# EAGLE design multi (EAGLE 6.4)
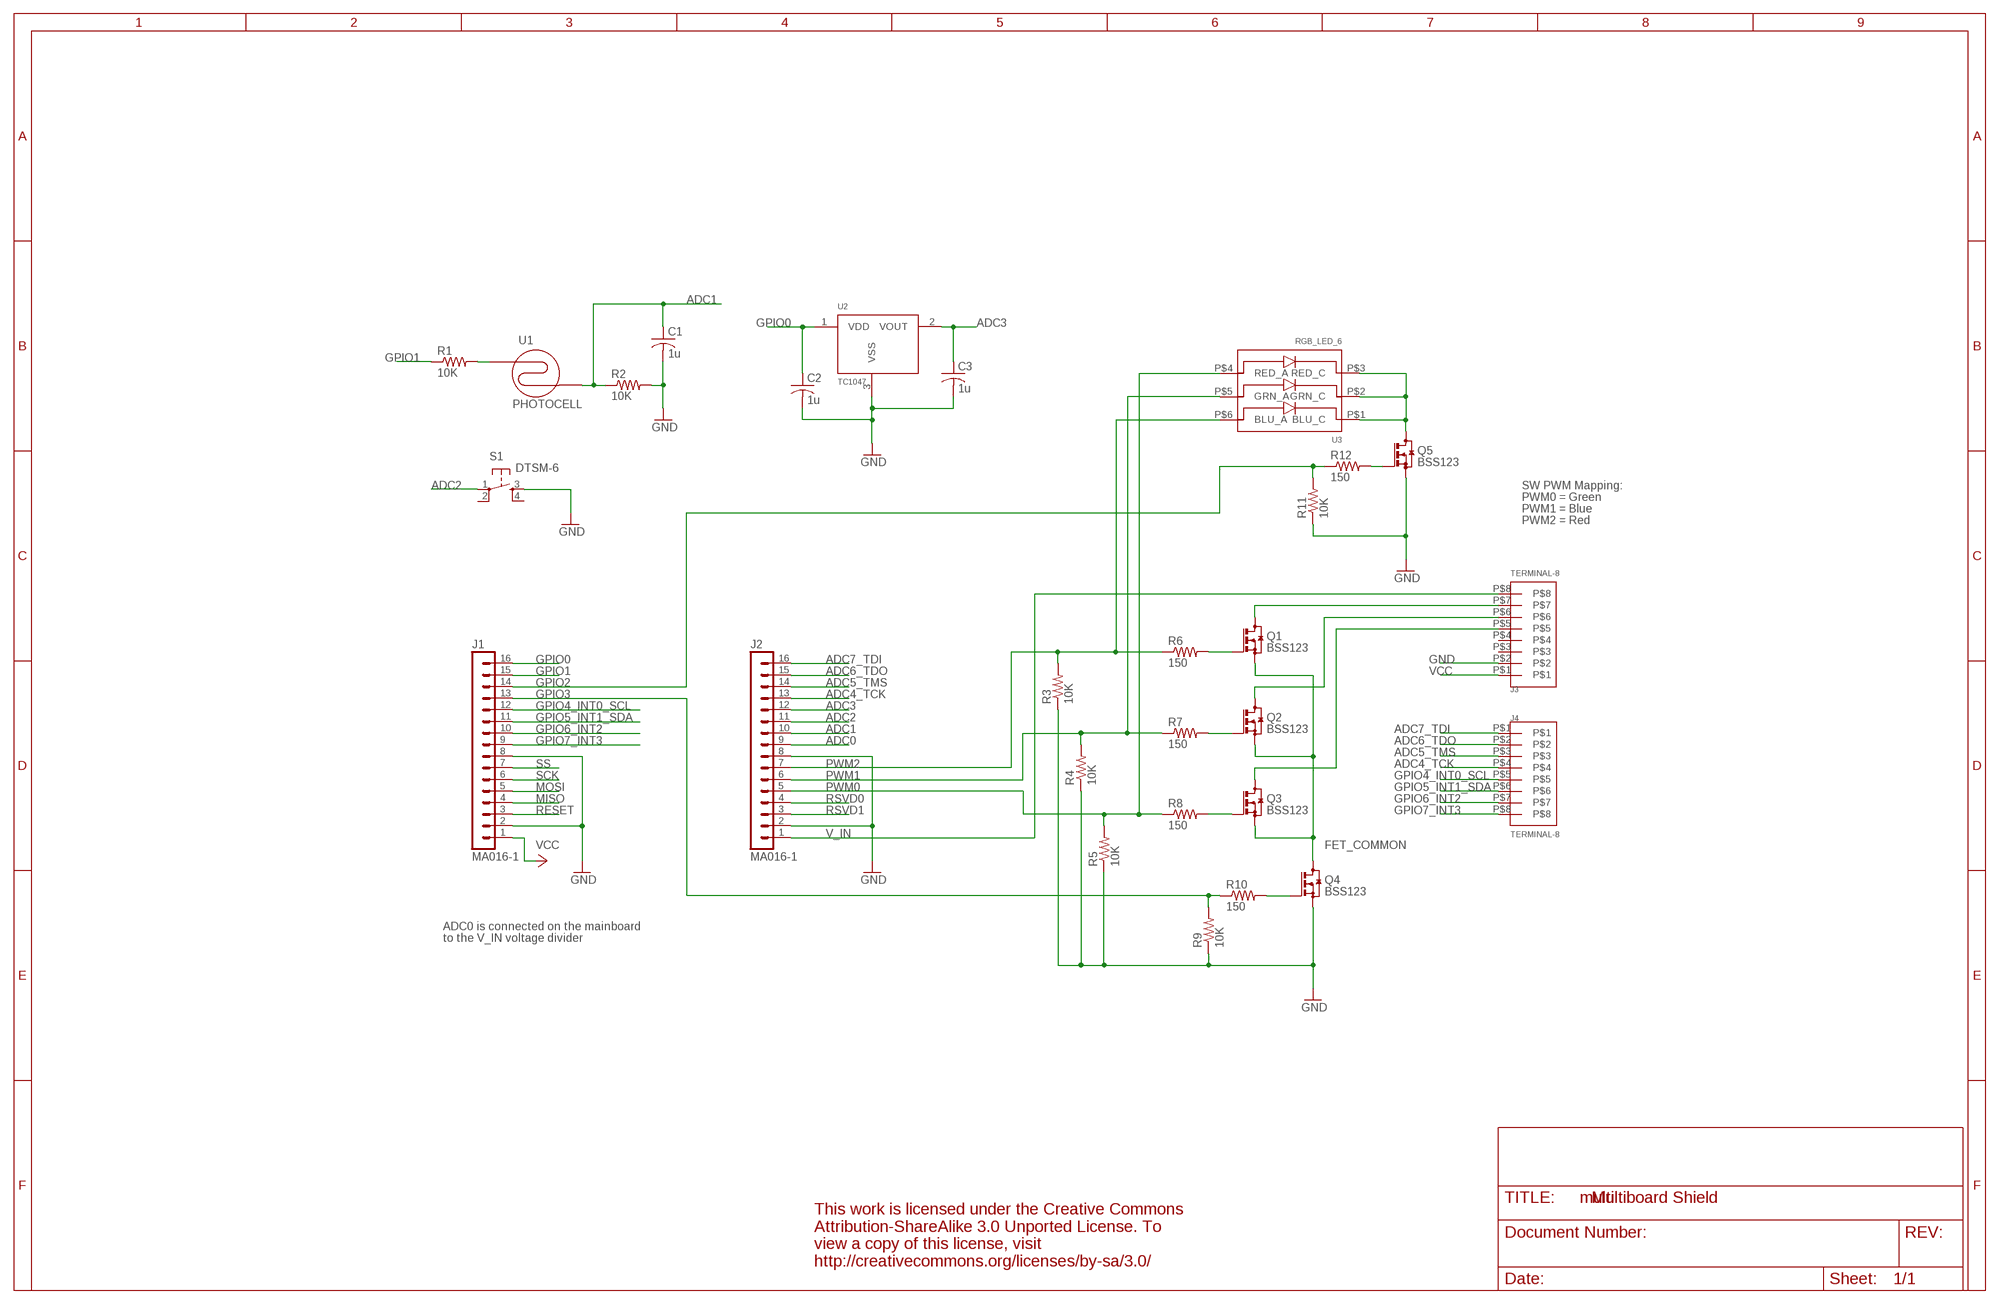
[diagram p0: schematic, sheet 1]

## Parts
C1  1u  C-USC0603K  [C0603K]
C2  1u  C-USC0603K  [C0603K]
C3  1u  C-USC0603K  [C0603K]
J1  MA016-1  [MA016-1]
J2  MA016-1  [MA016-1]
J3  TERMINAL-8  [TERMINAL-8]
J4  TERMINAL-8  [TERMINAL-8]
Q1  BSS123  [SOT23]
Q2  BSS123  [SOT23]
Q3  BSS123  [SOT23]
Q4  BSS123  [SOT23]
Q5  BSS123  [SOT23]
R1  10K  R-US_R0603  [R0603]
R2  10K  R-US_R0603  [R0603]
R3  10K  R-US_R0603  [R0603]
R4  10K  R-US_R0603  [R0603]
R5  10K  R-US_R0603  [R0603]
R6  150  R-US_R0603  [R0603]
R7  150  R-US_R0603  [R0603]
R8  150  R-US_R0603  [R0603]
R9  10K  R-US_R0603  [R0603]
R10  150  R-US_R0603  [R0603]
R11  10K  R-US_R0603  [R0603]
R12  150  R-US_R0603  [R0603]
S1  DTSM-6  [DTSM-6]
U1  PHOTOCELL  [PHOTOCELL]
U2  TC1047  [SOT23]
U3  RGB_LED_6  [PLCC6]

## Nets
ADC0: J2.9
ADC1: C1.1 J2.10 R2.1 U1.P$2
ADC2: J2.11 S1.1
ADC3: C3.1 J2.12 U2.2(VOUT)
ADC4_TCK: J2.13 J4.P$4
ADC5_TMS: J2.14 J4.P$3
ADC6_TDO: J2.15 J4.P$2
ADC7_TDI: J2.16 J4.P$1
FET_COMMON: Q1.2(S) Q2.2(S) Q3.2(S) Q4.3(D)
GND: C1.2 C2.2 C3.2 J1.2 J1.8 J2.2 J2.8 J3.P$2 Q4.2(S) Q5.2(S) R2.2 R3.1 R4.1 R5.1 R9.1 R11.1 S1.3 U2.3(VSS)
GPIO0: C2.1 J1.16 U2.1(VDD)
GPIO1: J1.15 R1.1
GPIO2: J1.14 R11.2 R12.1
GPIO3: J1.13 R9.2 R10.1
GPIO4_INT0_SCL: J1.12 J4.P$5
GPIO5_INT1_SDA: J1.11 J4.P$6
GPIO6_INT2: J1.10 J4.P$7
GPIO7_INT3: J1.9 J4.P$8
INA: Q2.1(G) R7.2
INB: Q1.1(G) R6.2
MISO: J1.4
MOSI: J1.5
N$1: R1.2 U1.P$1
N$2: Q5.3(D) U3.P$1(BLU_C) U3.P$2(GRN_C) U3.P$3(RED_C)
N$4: Q5.1(G) R12.2
N$5: Q3.1(G) R8.2
N$6: Q4.1(G) R10.2
OUT0: J3.P$5 Q3.3(D)
OUT1: J3.P$6 Q2.3(D)
OUT2: J3.P$7 Q1.3(D)
PWM0: J2.5 R5.2 R8.1 U3.P$4(RED_A)
PWM1: J2.6 R4.2 R7.1 U3.P$5(GRN_A)
PWM2: J2.7 R3.2 R6.1 U3.P$6(BLU_A)
RESET: J1.3
RSVD0: J2.4
RSVD1: J2.3
SCK: J1.6
SS: J1.7
V_IN: J2.1 J3.P$8
VCC: J1.1 J3.P$1
Unconnected: J3.P$3 J3.P$4 S1.2 S1.4

## Notes on the sheet
- SW PWM Mapping:
- PWM0 = Green
- PWM1 = Blue
- PWM2 = Red
- ADC0 is connected on the mainboard
- to the V_IN voltage divider
- Multiboard Shield

## Library data of the parts
C1-C3 = rcl:C-US: CAPACITOR, American symbol
J1 J2 = sapphire:MA016-1
J3 J4 = sapphire:TERMINAL-8
Q1-Q5 = transistor-small-signal:BSS123: N-CHANNEL MOS FET
R1-R12 = rcl:R-US_: RESISTOR, American symbol
S1 = sapphire:DTSM-6
U1 = sapphire:PHOTOCELL
U2 = sapphire:TC1047
U3 = sapphire:RGB_LED_6

## Board
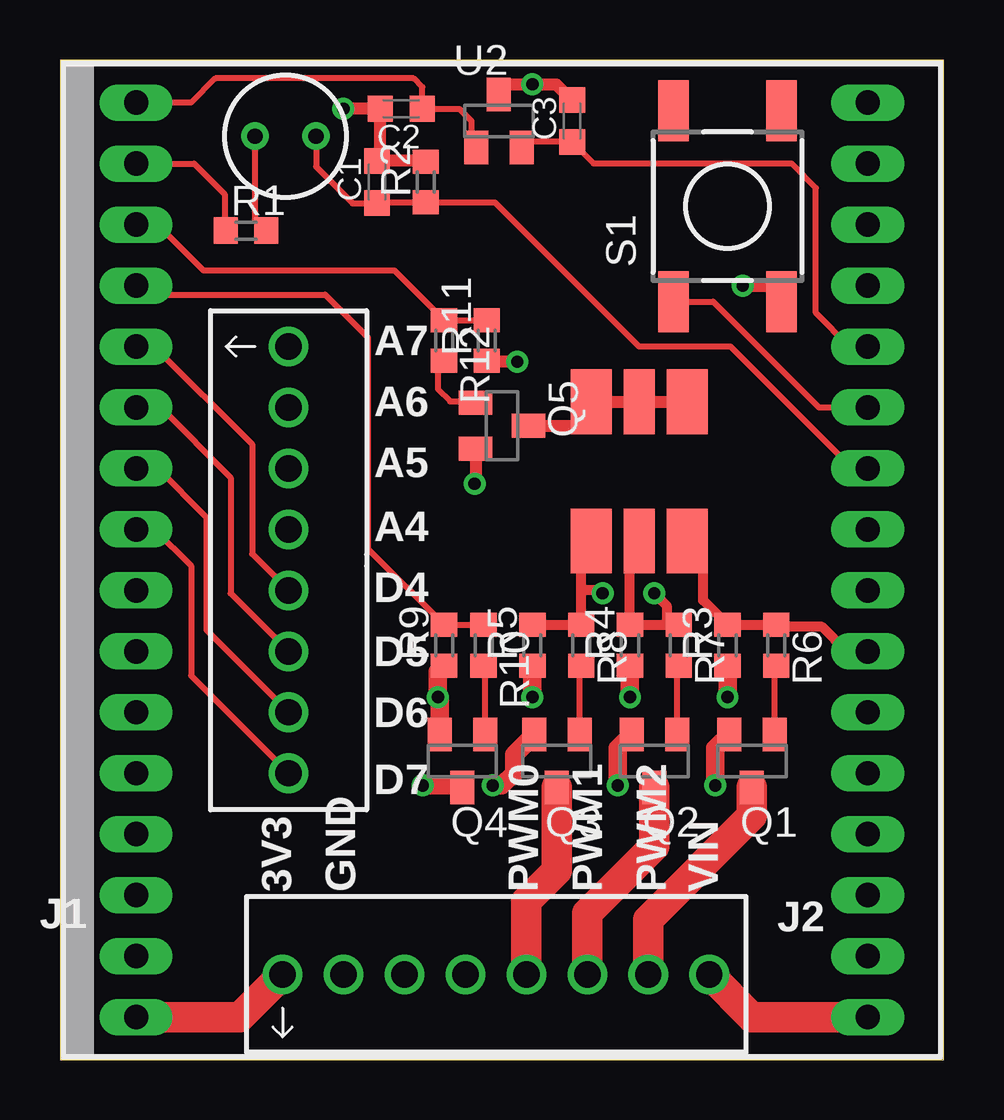
[diagram p1: board, top side]
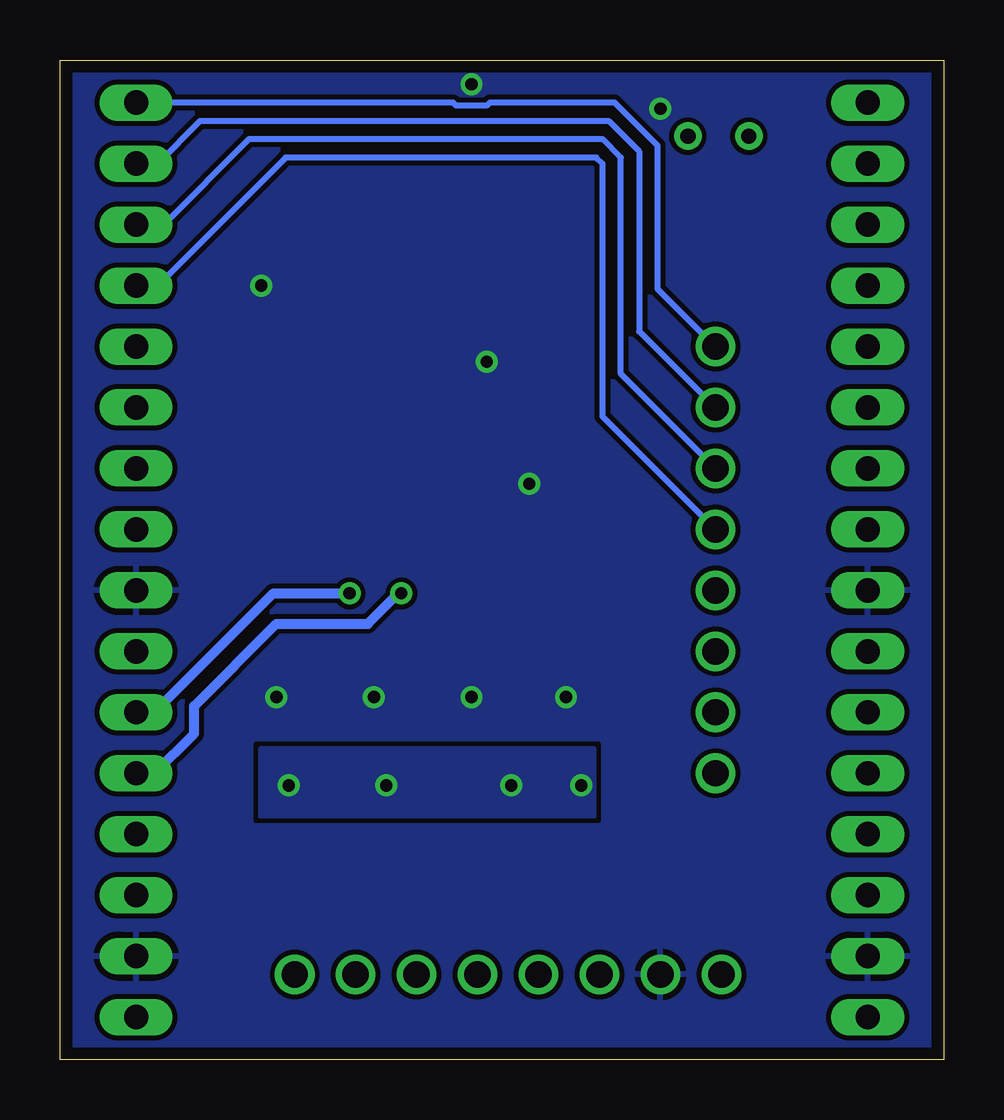
[diagram p2: board, bottom side, seen from below]

Size 36.83 x 41.66 mm. Coordinates in mm from the lower left corner, seen from the top.
Outline: 0,0 36.83,0 36.83,41.66 0,41.66 0,0
Copper layers (1*16): Top 0.035mm / dielectric 1.5mm / Bottom 0.035mm
Design rules "default": minimum track width 10mil, minimum drill 20mil, track to track 8mil, track to pad 8mil, pad to pad 6mil, via to via 8mil, smd to smd 8mil, copper to edge 20mil, drill to drill 8mil, minimum pad ring 10mil, minimum via ring 8mil, stop-mask expansion 4mil, vias tented up to drill 0mil, thermal gap 10mil

### Footprints (pad centres in the part's own frame; a part is rotated, then mirrored left to right if it is on the bottom)
C0603K = smd 1.05 x 1.08: 1 -0.875,0; 2 0.875,0
MA016-1 = drill 1.016 long: 1 -19.05,0; 2 -16.51,0; 3 -13.97,0; 4 -11.43,0; 5 -8.89,0; 6 -6.35,0; 7 -3.81,0; 8 -1.27,0; 9 1.27,0; 10 3.81,0; 11 6.35,0; 12 8.89,0; 13 11.43,0; 14 13.97,0; 15 16.51,0; 16 19.05,0
TERMINAL-8 = drill 1.1: P$1 -8.89,0; P$2 -6.35,0; P$3 -3.81,0; P$4 -1.27,0; P$5 1.27,0; P$6 3.81,0; P$7 6.35,0; P$8 8.89,0
SOT23 = smd 1 x 1.4: 1 -0.95,-1.1; 2 0.95,-1.1; 3 0,1.1
R0603 = smd 1 x 1.1: 1 -0.85,0; 2 0.85,0
DTSM-6 = smd 2.54 x 1.27: 1 -3.975,2.25; 2 3.975,2.25; 3 -3.975,-2.25; 4 3.975,-2.25
PHOTOCELL = drill 0.635: P$1 -1.27,0; P$2 1.27,0
PLCC6 = smd 2.7 x 1.7: P$1 -2.9,2; P$3 -2.9,-2; P$4 2.9,-2; P$6 2.9,2 | smd 2.7 x 1.3: P$2 -2.9,0; P$5 2.9,0

### Placement (x,y rotation side)
C1  13.21,36.58 90 top
C2  14.22,39.62 180 top
C3  21.34,39.12 90 top
J1  3.17,20.83 90 top
J2  33.66,20.83 90 top
J3  18.16,3.56 0 top
J4  9.53,20.83 270 top
Q1  28.83,12.45 180 top
Q2  24.77,12.45 180 top
Q3  20.7,12.45 180 top
Q4  16.76,12.45 180 top
Q5  18.41,26.42 270 top
R1  7.75,34.54 0 top
R2  15.24,36.58 90 top
R3  27.81,17.27 90 top
R4  23.75,17.27 90 top
R5  19.68,17.27 90 top
R6  29.84,17.27 270 top
R7  25.78,17.27 270 top
R8  21.72,17.27 270 top
R9  16,17.27 90 top
R10  17.65,17.27 270 top
R11  17.78,29.97 90 top
R12  16,29.97 270 top
S1  27.81,35.56 90 top
U1  9.4,38.48 0 top
U2  18.29,39.12 0 top
U3  24.13,24.51 270 top

### Tracks (layer width: path | path; a pad name or v marks a point on that pad's centre or on a via)
ADC1
  Top 0.254: U1.P$2 10.67,37.21 12.19,35.69 13.19,35.69 C1.1 13.23,35.73 R2.1 18.12,35.73 24.13,29.72 27.94,29.72 33.02,24.64 J2.10
ADC2
  Top 0.254: S1.1 27.22,31.59 31.62,27.18 J2.11
ADC3
  Top 0.254: J2.12 32.89,29.72 31.5,31.11 31.5,36.32 30.48,37.34 22.24,37.34 C3.1 19.46,38.24 U2.2
ADC4_TCK
  Bottom 0.254: J4.P$4 14.22,26.8 14.22,37.34 14.48,37.59 27.43,37.59 32.77,32.26 J2.13
ADC5_TMS
  Bottom 0.254: J4.P$3 13.46,28.57 13.46,37.59 14.22,38.35 28.96,38.35 32.51,34.8 J2.14
ADC6_TDO
  Bottom 0.254: J2.15 32.77,37.34 30.99,39.12 13.97,39.12 12.7,37.85 12.7,30.35 J4.P$2
ADC7_TDI
  Bottom 0.254: J4.P$1 11.94,32.13 11.94,38.1 13.72,39.88 18.92,39.88 19.05,39.75 20.32,39.75 20.45,39.88 J2.16
FET_COMMON  (via drill 0.51)
  Top 0.762: Q4.3 16.64,11.43 v15.11,11.43 | Q2.2 23.24,12.97 v23.24,11.43 | Q1.2 27.3,12.97 v27.3,11.43 | v18.03,11.43 18.41,11.43 18.92,11.94 18.92,12.72 Q3.2
  pour Bottom: 14.61,12.95 14.61,10.16 28.45,10.16 28.45,12.95
GND  (via drill 0.51)
  Top 0.508: v11.81,39.62 C2.2 13.35,37.59 C1.2 15.21,37.45 R2.2 | U2.3 18.71,40.64 v19.68,40.64 20.69,40.64 C3.2 | v28.45,32.26 29.97,32.26 29.97,31.68 S1.3 | v19.05,29.08 17.82,29.08 R11.1 | Q5.2 17.32,24.05 v17.27,24 | 15.81,15.05 v15.75,15.11
  Top 0.762: Q4.2 15.81,15.05 | v15.75,15.11 15.75,16.17 R9.1 | v19.68,15.11 R5.1 | v23.75,15.11 R4.1 | v27.81,15.11 R3.1
  pour Bottom (rank 2): -2.03,42.42 38.35,42.42 38.35,-1.65 -2.03,-1.65
GPIO0
  Top 0.254: J1.16 5.46,39.88 6.48,40.89 14.73,40.89 15.1,40.53 C2.1 16.64,39.62 17.14,39.12 17.14,38.21 U2.1
GPIO1
  Top 0.254: J1.15 5.59,37.34 6.86,36.07 6.86,34.58 R1.1
GPIO2
  Top 0.254: J1.14 4.06,34.8 5.97,32.89 13.93,32.89 R12.1 R11.2
GPIO3
  Top 0.254: J1.13 3.56,31.88 11.05,31.88 12.83,30.1 12.83,21.3 R9.2 R10.1
GPIO4_INT0_SCL
  Top 0.254: J4.P$5 8,21.08 8,25.65 3.94,29.72 J1.12
GPIO5_INT1_SDA
  Top 0.254: J4.P$6 7.11,19.43 7.11,24.26 4.19,27.18 J1.11
GPIO6_INT2
  Top 0.254: J1.10 4.06,24.64 6.1,22.61 6.1,17.91 J4.P$7
GPIO7_INT3
  Top 0.254: J1.9 3.94,22.1 5.46,20.57 5.46,16 J4.P$8
INA
  Top 0.254: Q2.1 25.71,16.36 R7.2
INB
  Top 0.254: Q1.1 29.78,16.36 R6.2
N$1
  Top 0.254: R1.2 8.13,35.01 U1.P$1
N$2
  Top 0.508: Q5.3 22.23,26.42 22.35,26.54 22.35,27.19 U3.P$3 U3.P$2 U3.P$1
N$4
  Top 0.254: R12.2 15.75,28.87 15.75,27.94 16.26,27.43 17.25,27.43 Q5.1
N$5
  Top 0.254: Q3.1 21.65,16.36 R8.2
N$6
  Top 0.254: Q4.1 17.71,16.36 R10.2
OUT0
  Top 1.27: Q3.3 20.7,7.87 19.43,6.6 J3.P$5
OUT1
  Top 1.27: Q2.3 24.77,8.89 21.97,6.1 J3.P$6
OUT2
  Top 1.27: Q1.3 28.83,10.16 24.51,5.84 J3.P$7
PWM0  (via drill 0.51)
  Top 0.406: 21.72,19.56 R8.1 R5.2 | 21.72,19.56 21.72,21.2 U3.P$4 | v22.61,19.43 22.61,19.56 21.72,19.56
  Bottom 0.406: J2.5 32.89,11.94 31.24,13.59 31.24,14.73 27.81,18.16 24,18.16 22.73,19.43 v22.61,19.43
PWM1  (via drill 0.51)
  Top 0.406: 24.07,21.91 23.75,21.59 R4.2 25.27,18.12 | 24.07,21.91 24.26,22.1 | U3.P$5 24.07,21.67 24.07,21.91 | 25.27,18.12 R7.1 | v24.77,19.43 25.27,18.92 25.27,18.12
  Bottom 0.406: J2.6 32.89,14.48 27.94,19.43 v24.77,19.43
PWM2
  Top 0.406: U3.P$6 26.13,21.24 26.8,20.57 26.8,19.14 R3.2 R6.1 29.93,18.03 31.75,18.03 32.77,17.02 J2.7
V_IN
  Top 1.27: J2.1 28.83,1.78 J3.P$8
VCC
  Top 1.27: J1.1 7.49,1.78 J3.P$1

### Text on the board
tSilk: A7 | A6 | A5 | A4 | D4 | D5 | D6 | D7 | 3V3 | GND | PWM0 | PWM1 | PWM2 | VIN